# Altium schematic sheet logic.SchDoc
size A4
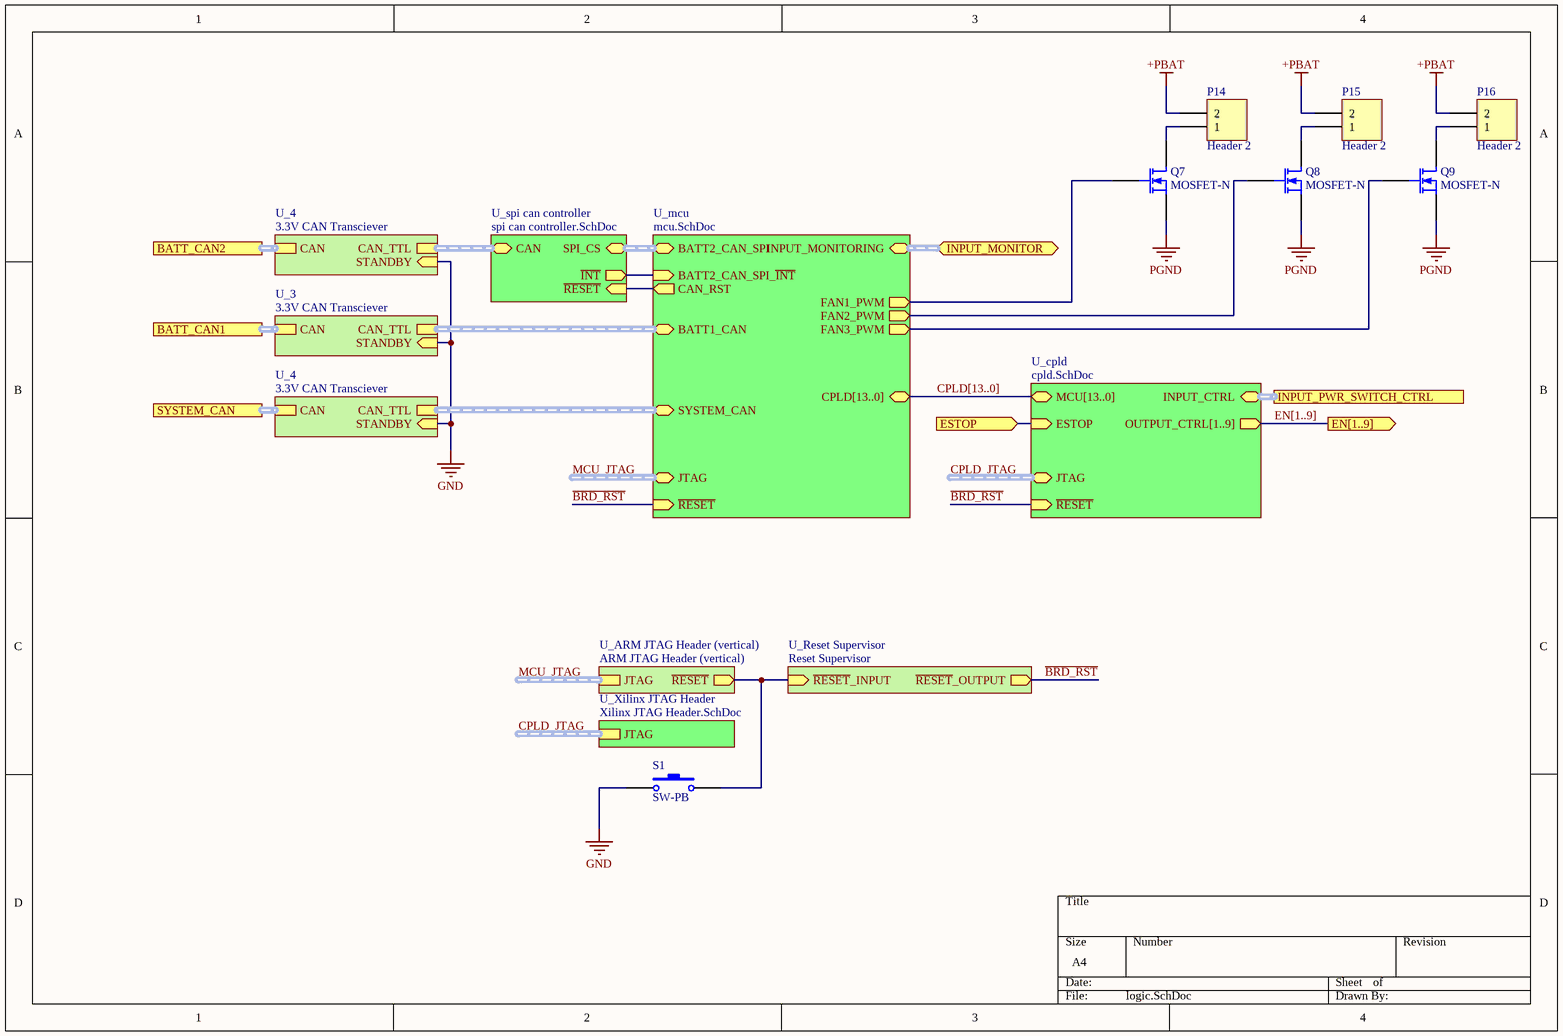
[diagram p0: logic.SchDoc]

## Parts
P14  Header 2  [HDR1X2]
P15  Header 2  [HDR1X2]
P16  Header 2  [HDR1X2]
Q7  MOSFET-N  [TSM2306CX]
Q8  MOSFET-N  [TSM2306CX]
Q9  MOSFET-N  [TSM2306CX]
S1  SW-PB  [DTSM-32S-B]

## Sub-sheets
U_3 = 3.3V CAN Transciever: CAN_TTL (harness CAN_TTL), CAN (harness CAN), STANDBY (in)
U_4 = 3.3V CAN Transciever: CAN_TTL (harness CAN_TTL), CAN (harness CAN), STANDBY (in)
U_4 = 3.3V CAN Transciever: CAN_TTL (harness CAN_TTL), CAN (harness CAN), STANDBY (in)
U_ARM JTAG Header (vertical) = ARM JTAG Header (vertical): JTAG (harness ARM_JTAG), ~{RESET} (out)
U_cpld = cpld.SchDoc: OUTPUT_CTRL[1..9] (out), INPUT_CTRL (harness PWR_CTRL), ESTOP (in), MCU[13..0] (bidir), JTAG (harness ARM_JTAG), ~{RESET} (in)
U_mcu = mcu.SchDoc: SYSTEM_CAN (harness CAN_TTL), BATT2_CAN_SPI (harness SPI_CS), BATT1_CAN (harness CAN_TTL), CPLD[13..0] (bidir), JTAG (harness ARM_JTAG), ~{RESET} (in), BATT2_CAN_SPI_~{INT} (in), CAN_RST (out), FAN1_PWM (out), FAN2_PWM (out), FAN3_PWM (out), INPUT_MONITORING (harness INPUT_MONITORING)
U_Reset Supervisor = Reset Supervisor: ~{RESET}_OUTPUT (out), ~{RESET}_INPUT (in)
U_spi can controller = spi can controller.SchDoc: CAN (harness CAN_TTL), SPI_CS (harness SPI_CS), ~{INT} (out), ~{RESET} (in)
U_Xilinx JTAG Header = Xilinx JTAG Header.SchDoc: JTAG (harness ARM_JTAG)

## Ports
BATT_CAN1 (harness CAN), BATT_CAN2 (harness CAN), EN[1..9] (out), ESTOP (in), INPUT_MONITOR (harness INPUT_MONITORING), INPUT_PWR_SWITCH_CTRL (harness PWR_CTRL), SYSTEM_CAN (harness CAN)

## Nets
+PBAT: P14.2 P15.2 P16.2
GND: S1.1 ; sheet U_3/STANDBY, sheet U_4/STANDBY, sheet U_4/STANDBY
PGND: Q7.3(S) Q8.3(S) Q9.3(S)
~{BRD_RST}: sheet U_cpld/~{RESET}, sheet U_mcu/~{RESET}, sheet U_Reset Supervisor/~{RESET}_OUTPUT
ESTOP: port ESTOP, sheet U_cpld/ESTOP
NetP14_1: P14.1 Q7.1(D)
NetP15_1: P15.1 Q8.1(D)
NetP16_1: P16.1 Q9.1(D)
NetQ7_2: Q7.2(G) ; sheet U_mcu/FAN1_PWM
NetQ8_2: Q8.2(G) ; sheet U_mcu/FAN2_PWM
NetQ9_2: Q9.2(G) ; sheet U_mcu/FAN3_PWM
NetS1_2: S1.2 ; sheet U_Reset Supervisor/~{RESET}_INPUT, sheet U_ARM JTAG Header (vertical)/~{RESET}
(unnamed): sheet U_mcu/BATT2_CAN_SPI_~{INT}, sheet U_spi can controller/~{INT}
(unnamed): sheet U_mcu/CAN_RST, sheet U_spi can controller/~{RESET}

## Buses and harness runs
bus CPLD[13..0] = sheet U_cpld/MCU[13..0] = sheet U_mcu/CPLD[13..0]
bus EN[1..9] = port EN[1..9] = sheet U_cpld/OUTPUT_CTRL[1..9]
harness CPLD_JTAG = sheet U_cpld/JTAG
harness CPLD_JTAG = sheet U_Xilinx JTAG Header/JTAG
harness MCU_JTAG = sheet U_ARM JTAG Header (vertical)/JTAG
harness MCU_JTAG = sheet U_mcu/JTAG
harness port BATT_CAN1 = sheet U_3/CAN
harness port BATT_CAN2 = sheet U_4/CAN
harness port INPUT_MONITOR = sheet U_mcu/INPUT_MONITORING
harness port INPUT_PWR_SWITCH_CTRL = sheet U_cpld/INPUT_CTRL
harness port SYSTEM_CAN = sheet U_4/CAN
harness sheet U_3/CAN_TTL = sheet U_mcu/BATT1_CAN
harness sheet U_4/CAN_TTL = sheet U_mcu/SYSTEM_CAN
harness sheet U_4/CAN_TTL = sheet U_spi can controller/CAN
harness sheet U_mcu/BATT2_CAN_SPI = sheet U_spi can controller/SPI_CS

## Library data of the parts
P14-P16 = Header 2: Header, 2-Pin; LatestRevisionDate: 17-Jul-2002; LatestRevisionNote: Re-released for DXP Platform.; Publisher: Altium Limited
Q7-Q9 = MOSFET-N: N-Channel MOSFET; Published: 8-Jun-2000; LatestRevisionDate: 17-Jul-2002; LatestRevisionNote: Re-released for DXP Platform.; PackageVersion: 1995/1996; PackageReference: E3; Publisher: Altium Limited; farnell: 1864577
S1 = SW-PB: Switch; Published: 24-Mar-1999; LatestRevisionDate: 17-Jul-2002; LatestRevisionNote: Re-released for DXP Platform.; PackageReference: SPST-2; Publisher: Altium Limited; farnell: 9471898